# EAGLE design Copter_Transmitter (EAGLE 7.5.0)
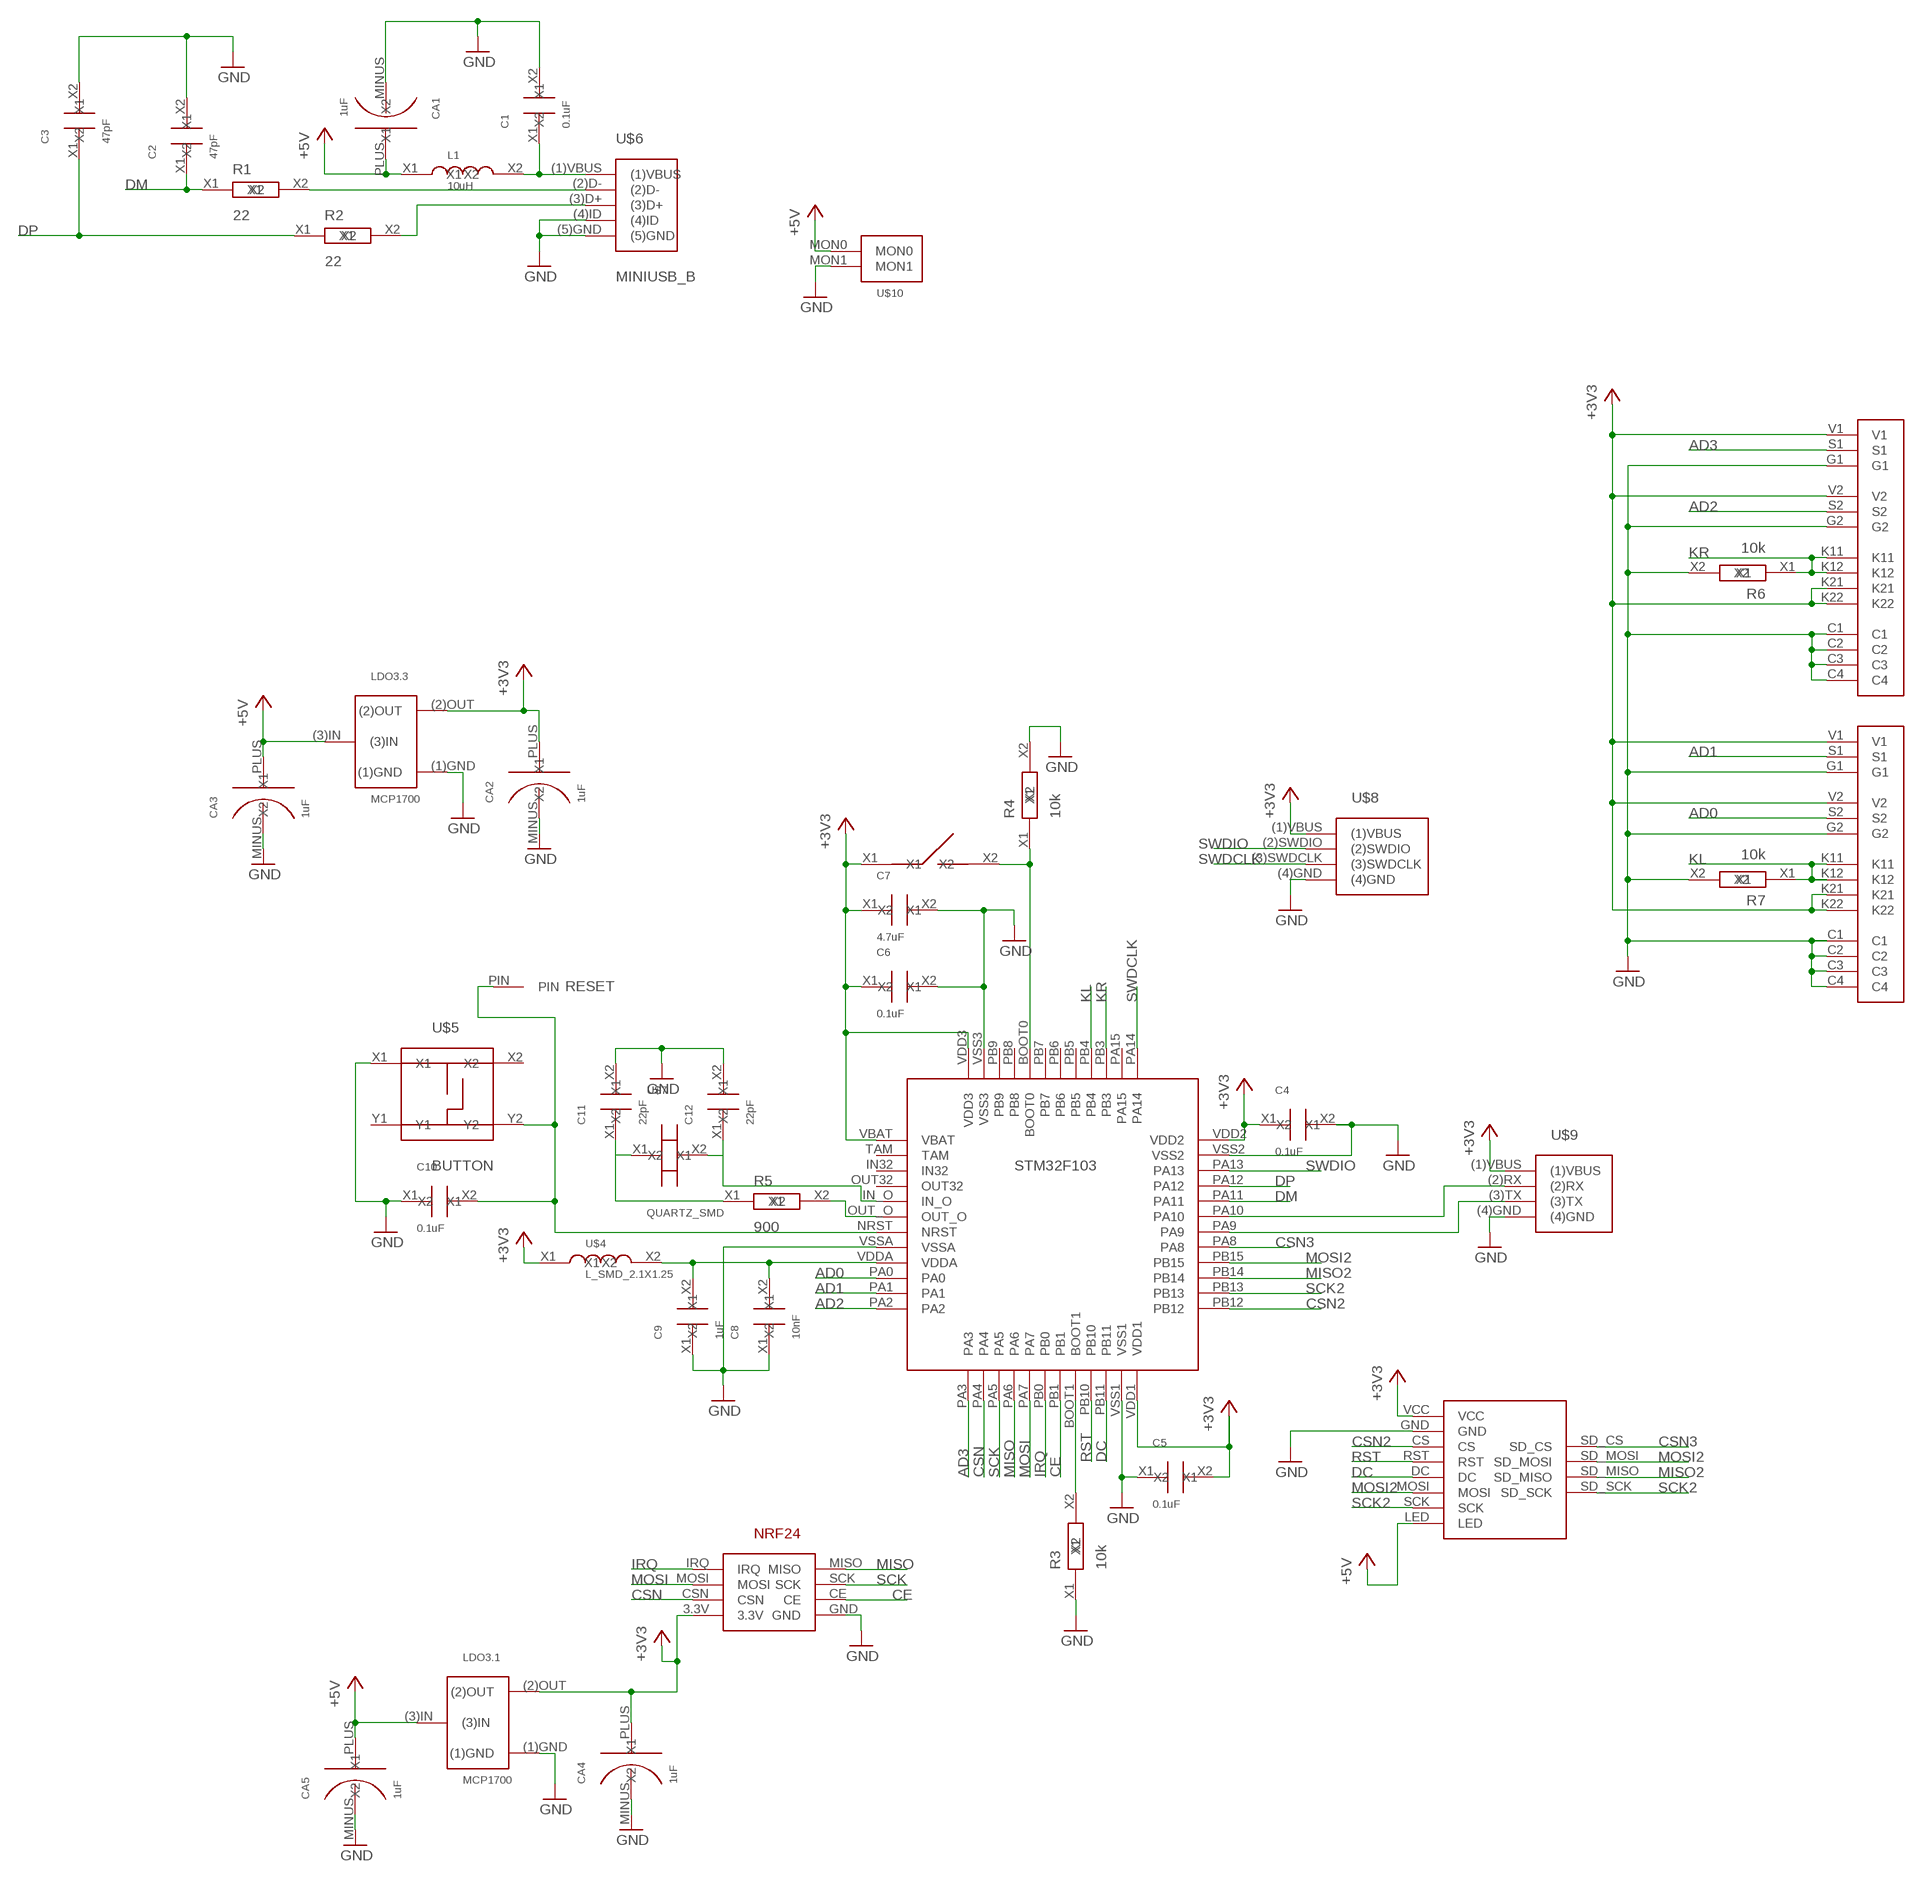
[diagram p0: schematic, sheet 1]

## Parts
C1  0.1uF  C_SMD_2.1X1.25  [SMD_2.1X1.25]
C2  47pF  C_SMD_2.1X1.25  [SMD_2.1X1.25]
C3  47pF  C_SMD_2.1X1.25  [SMD_2.1X1.25]
C4  0.1uF  C_SMD_2.1X1.25  [SMD_2.1X1.25]
C5  0.1uF  C_SMD_2.1X1.25  [SMD_2.1X1.25]
C6  0.1uF  C_SMD_2.1X1.25  [SMD_2.1X1.25]
C7  4.7uF  C_SMD_2.1X1.25  [SMD_2.1X1.25]
C8  10nF  C_SMD_2.1X1.25  [SMD_2.1X1.25]
C9  1uF  C_SMD_2.1X1.25  [SMD_2.1X1.25]
C10  0.1uF  C_SMD_2.1X1.25  [SMD_2.1X1.25]
C11  22pF  C_SMD_2.1X1.25  [SMD_2.1X1.25]
C12  22pF  C_SMD_2.1X1.25  [SMD_2.1X1.25]
CA1  1uF  C_SMD_TA_A  [C_SMD_TA_A]
CA2  1uF  C_SMD_TA_A  [C_SMD_TA_A]
CA3  1uF  C_SMD_TA_A  [C_SMD_TA_A]
CA4  1uF  C_SMD_TA_A  [C_SMD_TA_A]
CA5  1uF  C_SMD_TA_A  [C_SMD_TA_A]
L1  10uH  L_SMD_2.1X1.25  [SMD_2.1X1.25]
LDO3.1  MCP1700  [MCP1700]
LDO3.3  MCP1700  [MCP1700]
R1  22  R_SMD_2.1X1.25  [SMD_2.1X1.25]
R2  22  R_SMD_2.1X1.25  [SMD_2.1X1.25]
R3  10k  R_SMD_2.1X1.25  [SMD_2.1X1.25]
R4  10k  R_SMD_2.1X1.25  [SMD_2.1X1.25]
R5  900  R_SMD_2.1X1.25  [SMD_2.1X1.25]
R6  10k  R_SMD_2.1X1.25  [SMD_2.1X1.25]
R7  10k  R_SMD_2.1X1.25  [SMD_2.1X1.25]
RESET  PIN  [PIN]
STM32F103  STM32F103CBT6  [STM32F103CBT6]
U$1  TFT1.8_SD  [TFT1.8_SD]
U$2  NRF24_PLUG  [NRF24_PLUG]
U$3  DIP_1  [DIP_1]
U$4  L_SMD_2.1X1.25  [SMD_2.1X1.25]
U$5  BUTTON  [BUTTON]
U$6  MINIUSB_B  [MINIUSB_B]
U$7  QUARTZ_SMD  [QUARTZ_SMD]
U$8  SWD  [SWD]
U$9  USART  [USART]
U$10  MON2PIN  [MON2PIN]
U$11  JOYSTICK_MINI  [JOYSTICK_MINI]
U$12  JOYSTICK_MINI  [JOYSTICK_MINI]

## Nets
+3V3: C4.X1 C5.X2 C6.X1 C7.X1 CA2.PLUS(X2) CA4.PLUS(X2) LDO3.1.(2)OUT LDO3.3.(2)OUT STM32F103.VBAT STM32F103.VDD1 STM32F103.VDD2 STM32F103.VDD3 U$1.VCC U$2.3.3V U$3.X1 U$4.X1 U$8.(1)VBUS U$9.(1)VBUS U$11.K21 U$11.K22 U$11.V1 U$11.V2 U$12.K21 U$12.K22 U$12.V1 U$12.V2
+5V: CA1.PLUS(X2) CA3.PLUS(X2) CA5.PLUS(X2) L1.X1 LDO3.1.(3)IN LDO3.3.(3)IN U$1.LED U$10.MON0
AD0: STM32F103.PA0 U$11.S2
AD1: STM32F103.PA1 U$11.S1
AD2: STM32F103.PA2 U$12.S2
AD3: STM32F103.PA3 U$12.S1
CE: STM32F103.PB1 U$2.CE
CSN: STM32F103.PA4 U$2.CSN
CSN2: STM32F103.PB12 U$1.CS
CSN3: STM32F103.PA8 U$1.SD_CS
DC: STM32F103.PB11 U$1.DC
DM: C2.X1 R1.X1 STM32F103.PA11
DP: C3.X1 R2.X1 STM32F103.PA12
GND: C1.X2 C2.X2 C3.X2 C4.X2 C5.X1 C6.X2 C7.X2 C8.X1 C9.X1 C10.X1 C11.X2 C12.X2 CA1.MINUS(X1) CA2.MINUS(X1) CA3.MINUS(X1) CA4.MINUS(X1) CA5.MINUS(X1) LDO3.1.(1)GND LDO3.3.(1)GND R3.X1 R4.X2 R6.X2 R7.X2 STM32F103.VSS1 STM32F103.VSS2 STM32F103.VSS3 STM32F103.VSSA U$1.GND U$2.GND U$5.X1 U$6.(4)ID U$6.(5)GND U$8.(4)GND U$9.(4)GND U$10.MON1 U$11.C1 U$11.C2 U$11.C3 U$11.C4 U$11.G1 U$11.G2 U$12.C1 U$12.C2 U$12.C3 U$12.C4 U$12.G1 U$12.G2
IRQ: STM32F103.PB0 U$2.IRQ
KL: R7.X1 STM32F103.PB4 U$11.K11 U$11.K12
KR: R6.X1 STM32F103.PB3 U$12.K11 U$12.K12
MISO: STM32F103.PA6 U$2.MISO
MISO2: STM32F103.PB14 U$1.SD_MISO
MOSI: STM32F103.PA7 U$2.MOSI
MOSI2: STM32F103.PB15 U$1.MOSI U$1.SD_MOSI
N$1: C1.X1 L1.X2 U$6.(1)VBUS
N$2: R3.X2 STM32F103.BOOT1
N$3: R1.X2 U$6.(2)D-
N$4: R2.X2 U$6.(3)D+
N$5: R4.X1 STM32F103.BOOT0 U$3.X2
N$6: R5.X2 STM32F103.OUT_O
N$7: C11.X1 R5.X1 U$7.X1
N$8: C12.X1 STM32F103.IN_O U$7.X2
N$9: C8.X2 C9.X2 STM32F103.VDDA U$4.X2
N$10: STM32F103.PA9 U$9.(3)TX
N$11: C10.X2 RESET.PIN STM32F103.NRST U$5.Y2
N$12: STM32F103.PA10 U$9.(2)RX
RST: STM32F103.PB10 U$1.RST
SCK: STM32F103.PA5 U$2.SCK
SCK2: STM32F103.PB13 U$1.SCK U$1.SD_SCK
SWDCLK: STM32F103.PA14 U$8.(3)SWDCLK
SWDIO: STM32F103.PA13 U$8.(2)SWDIO
Unconnected: STM32F103.IN32 STM32F103.OUT32 STM32F103.PA15 STM32F103.PB5 STM32F103.PB6 STM32F103.PB7 STM32F103.PB8 STM32F103.PB9 STM32F103.TAM U$5.X2 U$5.Y1

## Library data of the parts
C1-C12 = MyPowerComponents:C_SMD_2.1X1.25
CA1-CA5 = MyAmSys:C_SMD_TA_A
L1 U$4 = MyPowerComponents:L_SMD_2.1X1.25
LDO3.1 LDO3.3 = MyCMOSsensor:MCP1700
R1-R7 = MyPowerComponents:R_SMD_2.1X1.25
RESET = MySTM32F103RGT6:PIN
STM32F103 = My_STM32:STM32F103CBT6
U$1 = My_flight:TFT1.8_SD
U$2 = My_flight:NRF24_PLUG
U$3 = My_STM32L15x:DIP_1
U$5 = My_STM32:BUTTON
U$6 = MyCMOSsensor:MINIUSB_B
U$7 = MySTM32F103RGT6:QUARTZ_SMD
U$8 = MyCMOSsensor:SWD
U$9 = MyCMOSsensor:USART
U$10 = MyCMOSsensor:MON2PIN
U$11 U$12 = My_flight:JOYSTICK_MINI

## Board
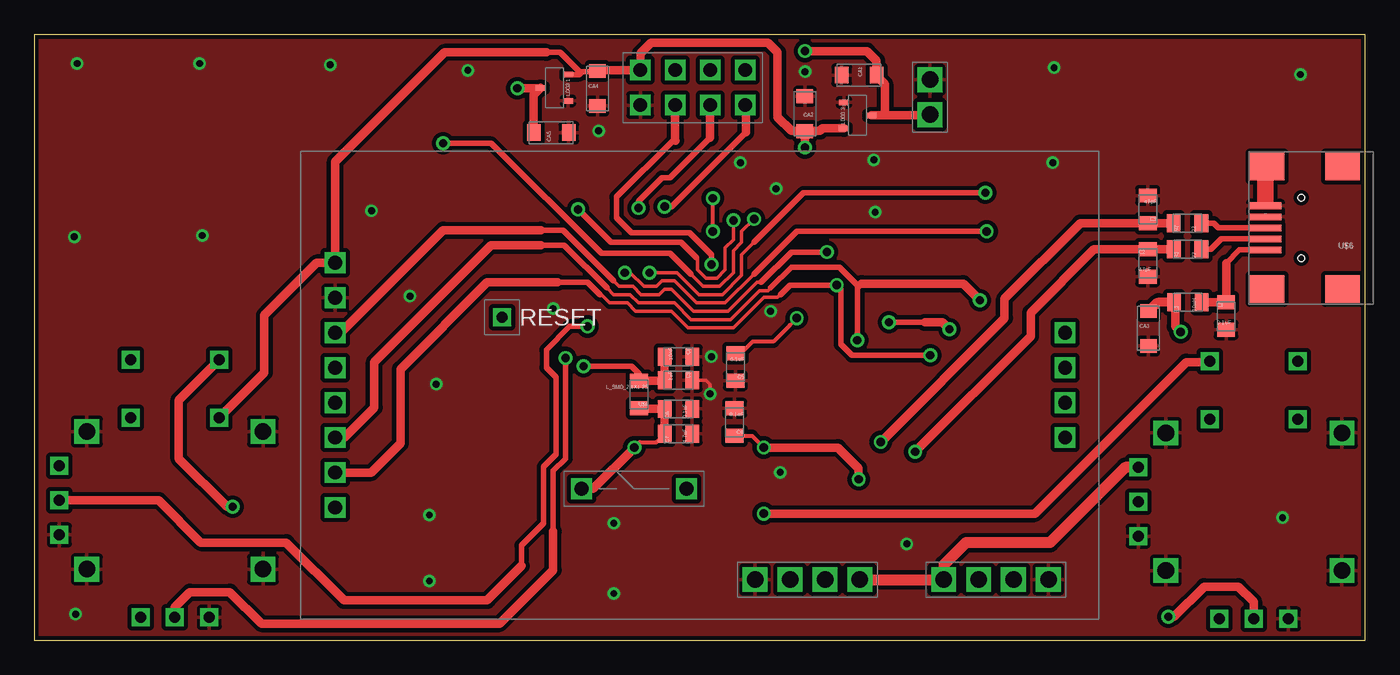
[diagram p1: board, top side]
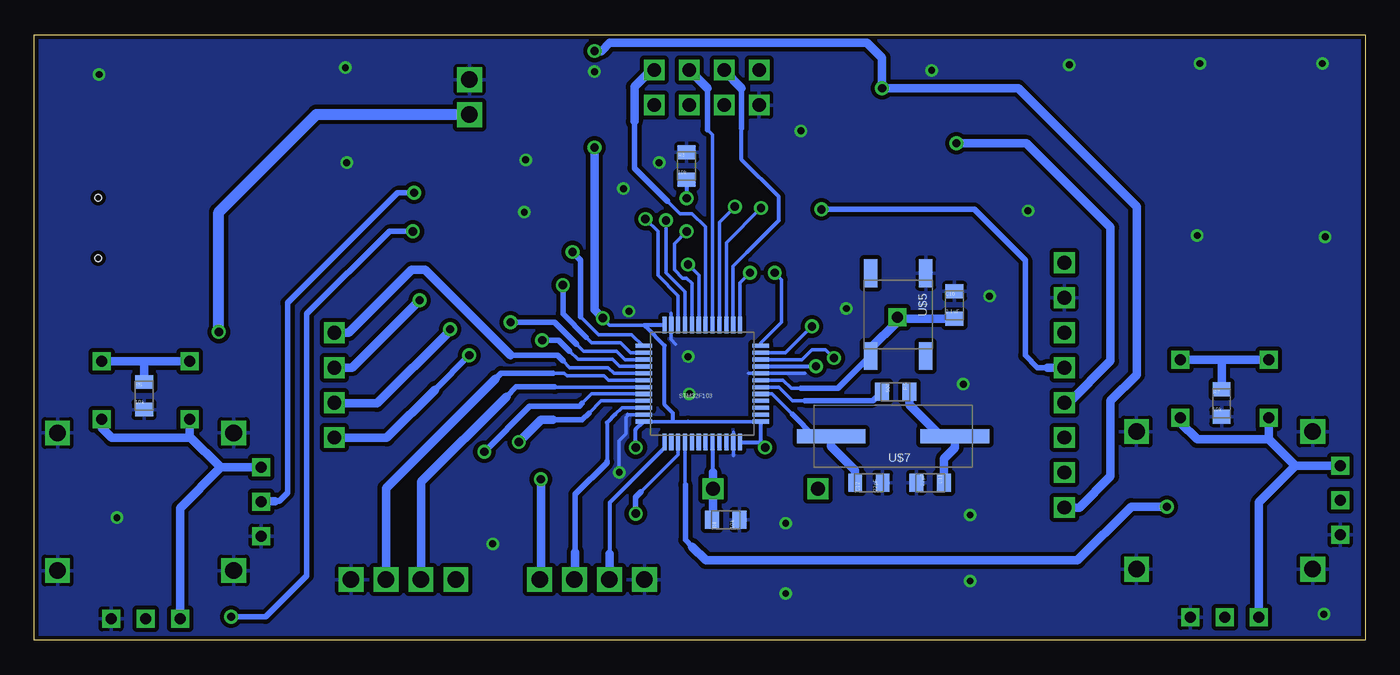
[diagram p2: board, bottom side, seen from below]

Size 96.7 x 44 mm. Coordinates in mm from the lower left corner, seen from the top.
Outline: 0,0 96.7,0 96.7,44 0,44 0,0
Copper layers (1*16): Top 0.035mm / dielectric 1.5mm / Bottom 0.035mm
Design rules "default *": minimum track width 10mil, minimum drill 24mil, track to track 8mil, track to pad 8mil, pad to pad 8mil, via to via 8mil, smd to smd 8mil, copper to edge 4mil, drill to drill 8mil, minimum pad ring 10mil, minimum via ring 8mil, stop-mask expansion 4mil, vias tented up to drill 0mil, thermal gap 10mil

### Footprints (pad centres in the part's own frame; a part is rotated, then mirrored left to right if it is on the bottom)
SMD_2.1X1.25 = smd 1.3 x 1: X1 0,1; X2 0,-1
C_SMD_TA_A = smd 1.2 x 1: MINUS 0,-1.27; PLUS 0,1.27
MCP1700 = smd 0.4 x 0.7: (1)GND -0.95,-2; (2)OUT 0.95,-2; (3)IN 0,0
PIN = drill 0.8 square: PIN 0,0
STM32F103CBT6 = smd 0.3 x 1.2: BOOT0 -0.75,4.25; BOOT1 0.75,-4.25; PA3 -2.75,-4.25; PA4 -2.25,-4.25; PA5 -1.75,-4.25; PA6 -1.25,-4.25; PA7 -0.75,-4.25; PA14 2.75,4.25; PA15 2.25,4.25; PB0 -0.25,-4.25; PB1 0.25,-4.25; PB3 1.75,4.25; PB4 1.25,4.25; PB5 0.75,4.25; PB6 0.25,4.25; PB7 -0.25,4.25; PB8 -1.25,4.25; PB9 -1.75,4.25; PB10 1.25,-4.25; PB11 1.75,-4.25; VDD1 2.75,-4.25; VDD3 -2.75,4.25; VSS1 2.25,-4.25; VSS3 -2.25,4.25 | smd 1.2 x 0.3: IN32 -4.25,1.75; IN_O -4.25,0.75; NRST -4.25,-0.25; OUT32 -4.25,1.25; OUT_O -4.25,0.25; PA0 -4.25,-1.75; PA1 -4.25,-2.25; PA2 -4.25,-2.75; PA8 4.25,-0.75; PA9 4.25,-0.25; PA10 4.25,0.25; PA11 4.25,0.75; PA12 4.25,1.25; PA13 4.25,1.75; PB12 4.25,-2.75; PB13 4.25,-2.25; PB14 4.25,-1.75; PB15 4.25,-1.25; TAM -4.25,2.25; VBAT -4.25,2.75; VDD2 4.25,2.75; VDDA -4.25,-1.25; VSS2 4.25,2.25; VSSA -4.25,-0.75
TFT1.8_SD = drill 1 square: CS 0,3.81; DC 0,-1.27; GND 0,6.35; LED 0,-8.89; MOSI 0,-3.81; RST 0,1.27; SCK 0,-6.35; SD_CS 53.04,3.81; SD_MISO 53.04,-1.27; SD_MOSI 53.04,1.27; SD_SCK 53.04,-3.81; VCC 0,8.89
NRF24_PLUG = drill 1 square: 3.3V -1.27,-2.54; CE 1.27,0; CSN -1.27,0; GND 1.27,-2.54; IRQ -1.27,5.08; MISO 1.27,5.08; MOSI -1.27,2.54; SCK 1.27,2.54
DIP_1 = drill 1 square: X1 0,2.54; X2 0,-5.08
BUTTON = smd 2 x 1: X1 -3,2; X2 3,2; Y1 -3,-2; Y2 3,-2
MINIUSB_B = smd 2.3 x 0.5: (1)VBUS 0,1.6; (2)D- 0,0.8; (3)D+ 0,0; (4)ID 0,-0.8; (5)GND 0,-1.6 | smd 2.5 x 2: PG1 -0.1,-4.45; PG2 -5.6,-4.45; PG3 -5.6,4.45; PG4 -0.1,4.45 | hole 0.5: -2.6,2.2; -2.6,-2.2
QUARTZ_SMD = smd 5 x 1: X1 -4.5,0; X2 4.5,0
SWD = drill 1.2 square: (1)VBUS 0,5.08; (2)SWDIO 0,2.54; (3)SWDCLK 0,0; (4)GND 0,-2.54
USART = drill 1.2 square: (1)VBUS 0,5.08; (2)RX 0,2.54; (3)TX 0,0; (4)GND 0,-2.54
MON2PIN = drill 1.2 square: MON0 0,2.54; MON1 0,0
JOYSTICK_MINI = drill 1.2 square: C1 0,5; C2 12.8,5; C3 12.8,-5; C4 0,-5 | drill 0.8 square: G1 -2,-2.5; G2 8.9,-8.5; K11 3.2,10.2; K12 9.6,10.2; K21 3.2,6; K22 9.6,6; S1 -2,0; S2 6.4,-8.5; V1 -2,2.5; V2 3.9,-8.5

### Placement (x,y rotation side)
C1  86.6,23.55 0 top
C2  80.9,27.4 0 top
C3  80.9,31.3 180 top
C4  50.88,15.85 180 top
C5  50.94,19.85 180 top
C6  46.8,16.8 90 top
C7  46.8,15 90 top
C8  46.8,20.6 270 top
C9  46.8,18.9 270 top
C10  29.84,24.35 0 bottom
C11  31.6,11.45 270 bottom
C12  36.06,11.45 90 bottom
CA1  59.93,41.05 270 top
CA2  55.99,38.25 180 top
CA3  80.95,22.65 0 top
CA4  40.92,40.08 0 top
CA5  37.56,36.88 90 top
L1  83.82,24.55 90 top
LDO3.1  36.79,40.13 90 top
LDO3.3  60.82,38.13 270 top
R1  83.8,28.4 90 top
R2  83.79,30.3 90 top
R3  49.3,34.45 0 bottom
R4  46.46,8.75 90 bottom
R5  34.12,18.05 270 bottom
R6  88.73,17.76 0 bottom
R7  10.43,17.23 0 bottom
RESET  33.98,23.46 0 top
STM32F103  48.17,18.64 180 bottom
U$1  21.86,18.53 0 top
U$2  46.57,40.15 270 top
U$3  42.3,11 90 top
U$4  43.94,17.85 180 top
U$5  33.93,23.66 270 bottom
U$6  89.46,29.95 180 top
U$7  34.3,14.81 180 bottom
U$8  54.91,4.41 270 top
U$9  71.15,4.41 90 top
U$10  65.08,40.72 180 top
U$11  3.81,10.16 0 top
U$12  82.22,10.06 0 top

### Tracks (layer width: path | path; a pad name or v marks a point on that pad's centre or on a via)
+3V3  (via drill 0.6)
  Top 0.254: 54.89,22.89 v55.4,23.4
  Top 0.305: v43.6,14 44,14.4 45.2,14.4 C7.X1 | C4.X1 52.15,14.85 v53,14 | 54.89,22.89 53.7,21.7 52.2,21.7 51.35,20.85 C5.X2
  Top 0.406: 39.6,41.1 39.8,41.3 40.87,41.3 CA4.PLUS | LDO3.1.(2)OUT 39.58,41.08 39.6,41.1 | 39.6,41.1 39.6,41.3 38.2,42.7 37.2,42.7
  Top 0.61: C7.X1 C6.X1 43.99,16.8 U$4.X1 | U$11.K22 16.7,19.45 16.7,23.6 20.52,27.42 U$1.VCC 21.86,34.76 29.8,42.7 37.2,42.7 | CA4.PLUS 40.99,41.42 U$2.3.3V 44.03,42.63 44.8,43.4 53.3,43.4 54,42.7 54,38 55,37 55.97,37 CA2.PLUS | LDO3.3.(2)OUT 57.28,37.18 57.1,37 56.01,37 CA2.PLUS | v43.6,14 40.6,11 U$3.X1 | U$8.(1)VBUS | v56,35.8 CA2.PLUS | v53,14 58.4,14 59.9,12.5 v59.9,11.7
  Top 0.813: U$8.(1)VBUS U$9.(1)VBUS 66.1,4.44 66.1,5.5 67.7,7.1 73.8,7.1 79.26,12.56 U$12.V1
  Bottom 0.254: STM32F103.VDD2 50.4,15.89 | 50.4,15.89 49.21,15.89 | 49.21,15.89 49.2,15.9 | 49.21,15.89 STM32F103.VBAT | 50.3,15.99 50.4,15.89 | 52.3,22.89 54.89,22.89 v55.4,23.4
  Bottom 0.305: STM32F103.VDD3 43.99,14.39 v43.6,14 43.92,14.32 STM32F103.VBAT | v53,14 53,15.31 STM32F103.VDD2 | STM32F103.VDD1 52.3,22.89 | 52.3,22.89 52.39,22.89 | 50.3,15.99 50.3,16.5 50.9,17.1 50.9,21.4 52.3,22.8 52.3,22.89
  Bottom 0.406: U$11.K21
  Bottom 0.61: U$11.V1 5.06,12.66 | 5.06,12.66 7,14.6 | 7,14.6 U$11.K21 | U$11.V2 7.71,10.01 5.06,12.66 | U$12.V1 83.16,12.56 | 83.16,12.56 85.4,14.8 | 85.4,14.8 85.4,16.04 U$12.K21 | U$12.V2 86.12,9.6 83.16,12.56 | U$11.K22 13.41,15.81 12.2,14.6 7,14.6 | U$12.K22 91.82,15.42 91.1,14.7 85.5,14.7 85.4,14.8 | v56,35.8 56,24 v55.4,23.4 | v59.9,11.7 59.9,4.5 U$8.(1)VBUS
+5V  (via drill 0.6)
  Top 0.406: LDO3.3.(3)IN 61.73,38.13 61.8,38.2 61.8,40.2 61.9,40.3 61.2,41
  Top 0.61: L1.X1 81.58,24.55 CA3.PLUS 81.02,23.92 81.7,24.6 82.9,24.6 82.9,22.8 v83.3,22.4 | CA5.PLUS 36.29,39.63 LDO3.1.(3)IN 36.76,40.1 v35.1,40.1 | LDO3.3.(3)IN 61.9,38.13 | 61.9,38.13 65.03,38.13 U$10.MON0 | 61.9,38.13 61.8,38.23 61.8,40.4 61.2,41 CA1.PLUS 61.2,42.1 60.5,42.8 v56,42.8
  Bottom 0.61: U$1.LED 20.76,9.64 18.5,11.9 18.5,17.4 16.6,19.3 16.6,31.5 25.2,40.1 v35.1,40.1 35.1,42.3 36.2,43.4 54.9,43.4 55.5,42.8 v56,42.8
  Bottom 0.813: v83.3,22.4 83.3,31.1 76.2,38.2 65.1,38.2 U$10.MON0
AD0  (via drill 0.6)
  Top 0.254: v38.6,20.5 38.6,20.2
  Top 0.406: 38.6,20.2 38.6,13.2 37.7,12.3 37.7,7.9
  Top 0.61: U$11.S2 10.21,2.41 11.3,3.5 14.2,3.5 16.5,1.2 33.8,1.2 37.7,5.1 37.7,7.9
  Bottom 0.254: STM32F103.PA0 40.91,20.39 40.2,21.1 39.2,21.1 v38.6,20.5
AD1  (via drill 0.6)
  Top 0.406: v40.2,22.8 38.9,22.8 37.2,21.1 37.2,19.8 37.9,19.1 37.9,13.5 37,12.6 37,8.5 35.4,6.9 35.4,5.4
  Top 0.61: U$11.S1 9.04,10.16 12.1,7.1 18.3,7.1 22.5,2.9 32.9,2.9 35.4,5.4
  Bottom 0.254: STM32F103.PA1 42.11,20.89 v40.2,22.8
AD2  (via drill 0.6)
  Top 0.254: v42.9,26.7 43.3,26.7 44.3,25.7 45.2,25.7 45.6,26.1 46.5,26.1 48.1,24.5 50.2,24.5 52.3,26.6
  Top 0.406: 52.3,26.6 55.4,29.7 v69.2,29.7
  Top 0.61: v82.4,1.7 82.8,1.7 85,3.9 87.5,3.9 88.6,2.8 88.6,1.58 U$12.S2
  Bottom 0.254: STM32F103.PA2 43.92,21.58 42.4,23.1 42.4,26.2 v42.9,26.7
  Bottom 0.406: v69.2,29.7 70.9,29.7 76.9,23.7 76.9,4.7 77.5,4.1 77.7,3.9 79.9,1.7 v82.4,1.7
AD3  (via drill 0.6)
  Top 0.254: v44.7,26.7 46.7,26.7 48.3,25.1 50,25.1 51.4,26.5 51.4,28 52.3,28.9
  Top 0.406: 52.3,28.9 55.9,32.5 v69.1,32.5
  Bottom 0.254: STM32F103.PA3 45.42,25.98 v44.7,26.7
  Bottom 0.406: v69.1,32.5 70.3,32.5 78.3,24.5 78.3,10.7 78.9,10.1 79.2,10.1
  Bottom 0.61: 79.2,10.1 80.18,10.1 U$12.S1
CE  (via drill 0.6)
  Top 0.406: 46.6,36.3 46.4,36.3 42.3,32.2 42.3,30.7 43.4,29.6 47.6,29.6 49.2,28 v49.2,27.3
  Top 0.61: U$2.CE 46.57,36.33 46.6,36.3
  Bottom 0.254: STM32F103.PB1 48.42,26.52 v49.2,27.3
CSN
  Bottom 0.254: STM32F103.PA4 45.92,27.18 44.9,28.2
  Bottom 0.305: 44.9,28.2 42.6,30.5 42.6,32.2 45.3,34.9 45.3,37.2
  Bottom 0.406: 45.3,40.1 45.3,37.2
  Bottom 0.61: U$2.CSN 46.57,41.37 45.3,40.1
CSN2  (via drill 0.6)
  Top 0.254: 42.1,26.1 42.5,25.7 43.5,25.7 44.1,25.1 45.4,25.1 45.8,25.5 46.3,25.5 47.9,23.9 50.4,23.9 52.5,26 52.8,26
  Top 0.406: 36.8,29.8 38.4,29.8 42.1,26.1 | 52.8,26 55,28.2 v57.6,28.2
  Top 0.61: U$1.CS 22.24,22.34 29.7,29.8 36.8,29.8
  Bottom 0.254: STM32F103.PB12 52.49,21.39 53.3,22.2 55.7,22.2 57,23.5
  Bottom 0.406: 57,23.5 57,27.6 v57.6,28.2
CSN3
  Bottom 0.254: STM32F103.PA8 54.59,19.39 55,19.8 57.8,19.8 58.3,20.3
  Bottom 0.406: 58.3,20.3 58.7,20.7 62.1,20.7
  Bottom 0.61: U$1.SD_CS 73.86,22.34 69.3,26.9 68.3,26.9 62.1,20.7
DC  (via drill 0.6)
  Top 0.254: v52.3,30.6 51.4,29.7 51.4,28.9 50.8,28.3 50.8,26.7 49.8,25.7 48.6,25.7 47.7,26.6
  Top 0.406: 47.7,26.6 46.2,28.1 41.2,28.1 33.2,36.1 v29.7,36.1
  Bottom 0.254: STM32F103.PB11 49.92,25.02 51.4,26.5 51.4,29.7 v52.3,30.6
  Bottom 0.61: U$1.DC 21.54,17.26 18.5,20.3 18.5,30 24.6,36.1 v29.7,36.1
DM  (via drill 0.6)
  Top 0.61: R1.X1 C2.X1 77,28.4 72.4,23.8 72.4,22.1 v64,13.7
  Bottom 0.254: STM32F103.PA11 56.21,17.89 56.9,17.2
  Bottom 0.406: 56.9,17.2 57.1,17 60.7,17 v64,13.7
DP  (via drill 0.6)
  Top 0.61: R2.X1 C3.X1 76,30.3 70.5,24.8 70.5,23.4 v61.5,14.4
  Bottom 0.254: STM32F103.PA12 55.51,17.39 56.4,16.5
  Bottom 0.406: 59,16 56.9,16 56.4,16.5
  Bottom 0.61: v61.5,14.4 59.9,16 59,16
GND  (via drill 0.5)
  Top 0.254: C9.X1 48.8,18.9 49.1,18.6 v49.1,17.9
  Bottom 0.254: 40.7,19.4 44.8,19.4 44.8,19.39 STM32F103.VSSA | 50.45,22.89 50.45,21.85 50.1,21.5 | STM32F103.VSS1 50.45,22.89 | 50.45,22.89 50.45,23.75 | 45.9,13.4 45.9,14.41 | 45.9,15.1 45.9,14.41 | 45.9,14.41 STM32F103.VSS3 | 53.6,16.4 53.59,16.39 STM32F103.VSS2 53.51,16.39 53.7,16.2 53.7,15 54.2,14.5 v54.2,12.2
  other vias: 49.2,20.6 56,41.3 41,37 51.3,34.7 27.3,25 37.7,24.1 53.5,23.9 53.9,32.8 61,34.9 74,34.7 74.1,41.6 92,41.1 21.5,41.8 3.1,41.9 2.9,29.3 12.2,29.4 12,41.9 24.5,31.2 29.2,18.6 3,1.9 31.5,41.4 63.4,7 28.7,9.1 28.7,4.3 42.1,3.4 42.1,8.5 90.7,8.9 61.1,31.1
  pour Bottom (isolate 0.305): 0,0 96.7,0 96.7,44 0,44
  pour Top (isolate 0.305): 0,0 96.7,0 96.7,44 0,44
IRQ
  Bottom 0.254: STM32F103.PB0 47.92,30.02 48.9,31 49.8,31 50.7,31.9
  Bottom 0.406: 50.7,31.9 53.1,34.3 53.1,37.7
  Bottom 0.61: U$2.IRQ 51.88,41.42 53.1,40.2 53.1,37.7
KL  (via drill 0.6)
  Top 0.61: v14.4,9.7 14,9.7 10.5,13.2 10.5,17.45 U$11.K12
  Bottom 0.254: STM32F103.PB4 49.42,11.32 49.4,11.3
  Bottom 0.406: 49.4,11.3 49.4,7.3 48.9,6.8
  Bottom 0.61: U$11.K11 10.4,20.36 | 10.4,20.36 U$11.K12 | R7.X1 10.43,20.33 10.4,20.36 | 48.9,6.8 47.9,5.8 20.9,5.8 17,9.7 v14.4,9.7
KR  (via drill 0.6)
  Top 0.61: v53,9.2 72.7,9.2 83.7,20.2 85.36,20.2 U$12.K11
  Bottom 0.254: STM32F103.PB3 49.92,13.48 52.6,10.8
  Bottom 0.406: 52.6,10.8 53,10.4 v53,9.2
  Bottom 0.61: U$12.K12 88.6,20.26 | 88.6,20.26 U$12.K11 | R6.X1 88.73,20.13 88.6,20.26
MISO  (via drill 0.6)
  Top 0.406: v45.8,31.5 46.3,31.5 51.7,36.9
  Top 0.61: 51.7,36.9 51.7,38.83 U$2.MISO
  Bottom 0.254: STM32F103.PA6 46.92,30.38 v45.8,31.5
MISO2  (via drill 0.6)
  Top 0.406: 64.7,23.1 v62.1,23.1
  Top 0.61: 64.7,23.1 66,23.1 v66.5,22.6
  Bottom 0.254: STM32F103.PB14 53.79,20.39 54.4,21 56.8,21 57.3,21.5
  Bottom 0.406: 57.3,21.5 58.9,23.1 v62.1,23.1
  Bottom 0.61: v66.5,22.6 66.5,22.5 71.8,17.2 74.84,17.2 U$1.SD_MISO
MOSI
  Bottom 0.254: STM32F103.PA7 47.42,36.72 47.8,37.1
  Bottom 0.406: 47.8,40.1 47.8,37.1
  Bottom 0.61: U$2.MOSI 47.8,40.1
MOSI2  (via drill 0.6)
  Top 0.254: 41.6,25.6 42.1,25.1 43.3,25.1 43.9,24.5 46.5,24.5 47.7,23.3 50.6,23.3 52.7,25.4 53.3,25.4 53.5,25.6
  Top 0.406: 36.8,28.7 38.5,28.7 41.6,25.6 | 53.5,25.6 55,27.1 58.5,27.1 59.8,25.8 59.8,25.6 | 59.8,25.6 v59.8,21.8 | 60.1,25.9 59.8,25.6
  Top 0.61: U$1.MOSI 22.52,14.72 24.7,16.9 24.7,20.2 33.2,28.7 36.8,28.7 | 60.1,25.9 67.5,25.9 v68.7,24.7
  Bottom 0.254: STM32F103.PB15 54.19,19.89 54.7,20.4 57.2,20.4 57.8,21
  Bottom 0.406: 57.8,21 58.6,21.8 v59.8,21.8
  Bottom 0.61: v68.7,24.7 73.6,19.8 U$1.SD_MOSI
N$1
  Top 0.406: U$6.(1)VBUS 87.55,28.35 86.6,27.4
  Top 0.61: L1.X2 C1.X1 86.6,27.4
N$2  (via drill 0.6)
  Top 0.305: v49.3,29.7 v49.3,32.1
  Bottom 0.254: STM32F103.BOOT1 48.92,25.92 49.3,26.3 49.6,26.3 50.2,26.9 50.2,28.8 v49.3,29.7
  Bottom 0.305: R3.X2 v49.3,32.1
N$3
  Top 0.406: U$6.(2)D- 86.25,29.15 85.5,28.4 R1.X2
N$4
  Top 0.406: U$6.(3)D+ 86.05,29.95 85.7,30.3 R2.X2
N$5
  Bottom 0.305: STM32F103.BOOT0 47.42,12.22 47.4,12.2
  Bottom 0.61: 47.4,12.2 47.4,11.02 U$3.X2 47.38,8.83 R4.X1
N$6
  Bottom 0.254: STM32F103.OUT_O 42.59,18.39 41.6,17.4 40.7,17.4
  Bottom 0.406: 40.7,17.4 35.77,17.4 R5.X2
N$7
  Bottom 0.61: C11.X1 30.6,13.2 29.8,14 U$7.X1 30.81,14.81 33.1,17.1 33.1,18.03 R5.X1
N$8
  Bottom 0.254: STM32F103.IN_O 43.09,17.89 41.6,16.4
  Bottom 0.406: 41.6,16.4 40,14.8 U$7.X2
  Bottom 0.61: C12.X1 37.06,12.36 38.8,14.1 U$7.X2
N$9  (via drill 0.6)
  Top 0.305: 44.45,18.8 44.5,18.85
  Top 0.406: U$4.X2 43.94,19.35 43.4,19.89 40.11,19.89 v39.9,19.9
  Top 0.61: C8.X2 C9.X2 45.75,18.85 44.5,18.85 U$4.X2
  Bottom 0.305: STM32F103.VDDA 42.01,19.89 v39.9,19.9
N$10
  Bottom 0.254: 59,19.4 58.2,19.4 58,19.2 55.3,19.2 54.99,18.89 STM32F103.PA9
  Bottom 0.406: 63.2,19 62.8,19.4 59,19.4
  Bottom 0.61: U$9.(3)TX 71.15,11.05 63.2,19
N$11
  Bottom 0.254: STM32F103.NRST 42.29,18.89 41.7,18.3 41,18.3
  Bottom 0.406: 41,18.3 38.29,18.3 U$5.Y2 35.93,21.2 35.93,21.43
  Bottom 0.61: 35.93,21.2 33.98,23.15 RESET.PIN 33.87,23.35 C10.X2
N$12
  Bottom 0.254: STM32F103.PA10 58.89,18.39 58.9,18.4
  Bottom 0.406: 58.9,18.4 61.7,18.4 62.4,17.7
  Bottom 0.61: 62.4,17.7 68.6,11.5 U$9.(2)RX
RST  (via drill 0.6)
  Top 0.254: v50.8,30.5 50.8,29.1 50.2,28.5 50.2,26.9 49.6,26.3 48.8,26.3 48.2,26.9 48.2,27.7 48.1,27.8
  Top 0.406: 48.1,27.8 47,28.9 41.9,28.9 v39.5,31.3
  Bottom 0.254: STM32F103.PB10 49.42,25.32 50.8,26.7 v50.8,30.5
  Bottom 0.406: v39.5,31.3 28.4,31.3 24.7,27.6 24.7,20.7 23.8,19.8 23.1,19.8
  Bottom 0.61: 23.1,19.8 U$1.RST
SCK  (via drill 0.6)
  Top 0.406: v43.9,31.4 43.9,31.9 45.6,33.6 46.2,33.6 49.1,36.5
  Top 0.61: 49.1,36.5 U$2.SCK
  Bottom 0.254: STM32F103.PA5 46.42,28.88 v43.9,31.4
SCK2  (via drill 0.6)
  Top 0.254: 41.1,25.1 41.2,25.1 41.8,24.5 43.1,24.5 43.7,23.9 46.3,23.9 47.5,22.7 50.8,22.7 53,24.9 54,24.9 54.2,25.1
  Top 0.406: 38,26 40.2,26 41.1,25.1 | 54.2,25.1 54.9,25.8 v58.3,25.8 58.6,25.5 58.6,21.5 59.4,20.7 v65.1,20.7
  Top 0.61: 38,26 32.9,26 26.6,19.7 26.6,14.3 24.48,12.18 U$1.SCK
  Bottom 0.254: STM32F103.PB13 53.39,20.89 54.1,21.6 56.2,21.6 56.6,22
  Bottom 0.406: v58.3,25.8 58.3,23.7 56.6,22 | v65.1,20.7 67.6,18.2
  Bottom 0.61: 67.6,18.2 71.1,14.7 74.88,14.7 U$1.SD_SCK
SWDCLK
  Bottom 0.305: STM32F103.PA14 50.92,13.98 54.9,10 54.9,6.3
  Bottom 0.61: 54.9,6.3 U$8.(3)SWDCLK
SWDIO
  Bottom 0.254: STM32F103.PA13 54.01,16.89 54.5,16.4
  Bottom 0.305: 54.5,16.4 55.1,15.8 55.1,13
  Bottom 0.406: 55.1,13 55.1,12.9 57.4,10.6 57.4,6.4
  Bottom 0.61: 57.4,6.4 57.4,4.46 U$8.(2)SWDIO